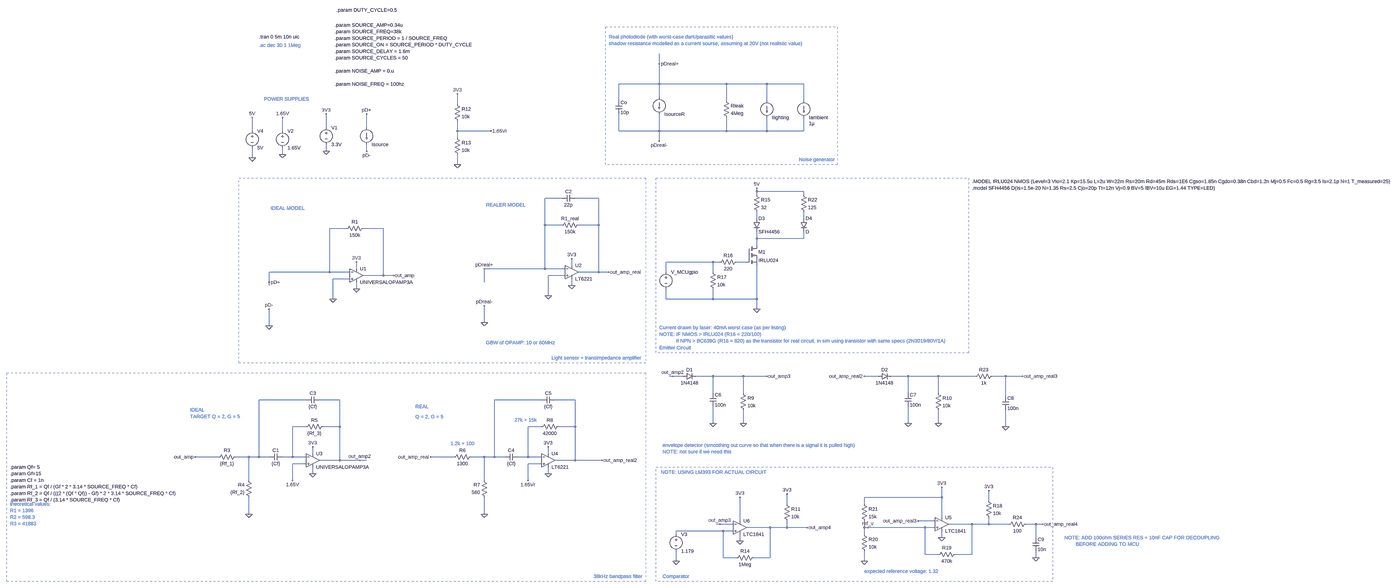
[diagram p0: schematic photodiode.asc, whole sheet]
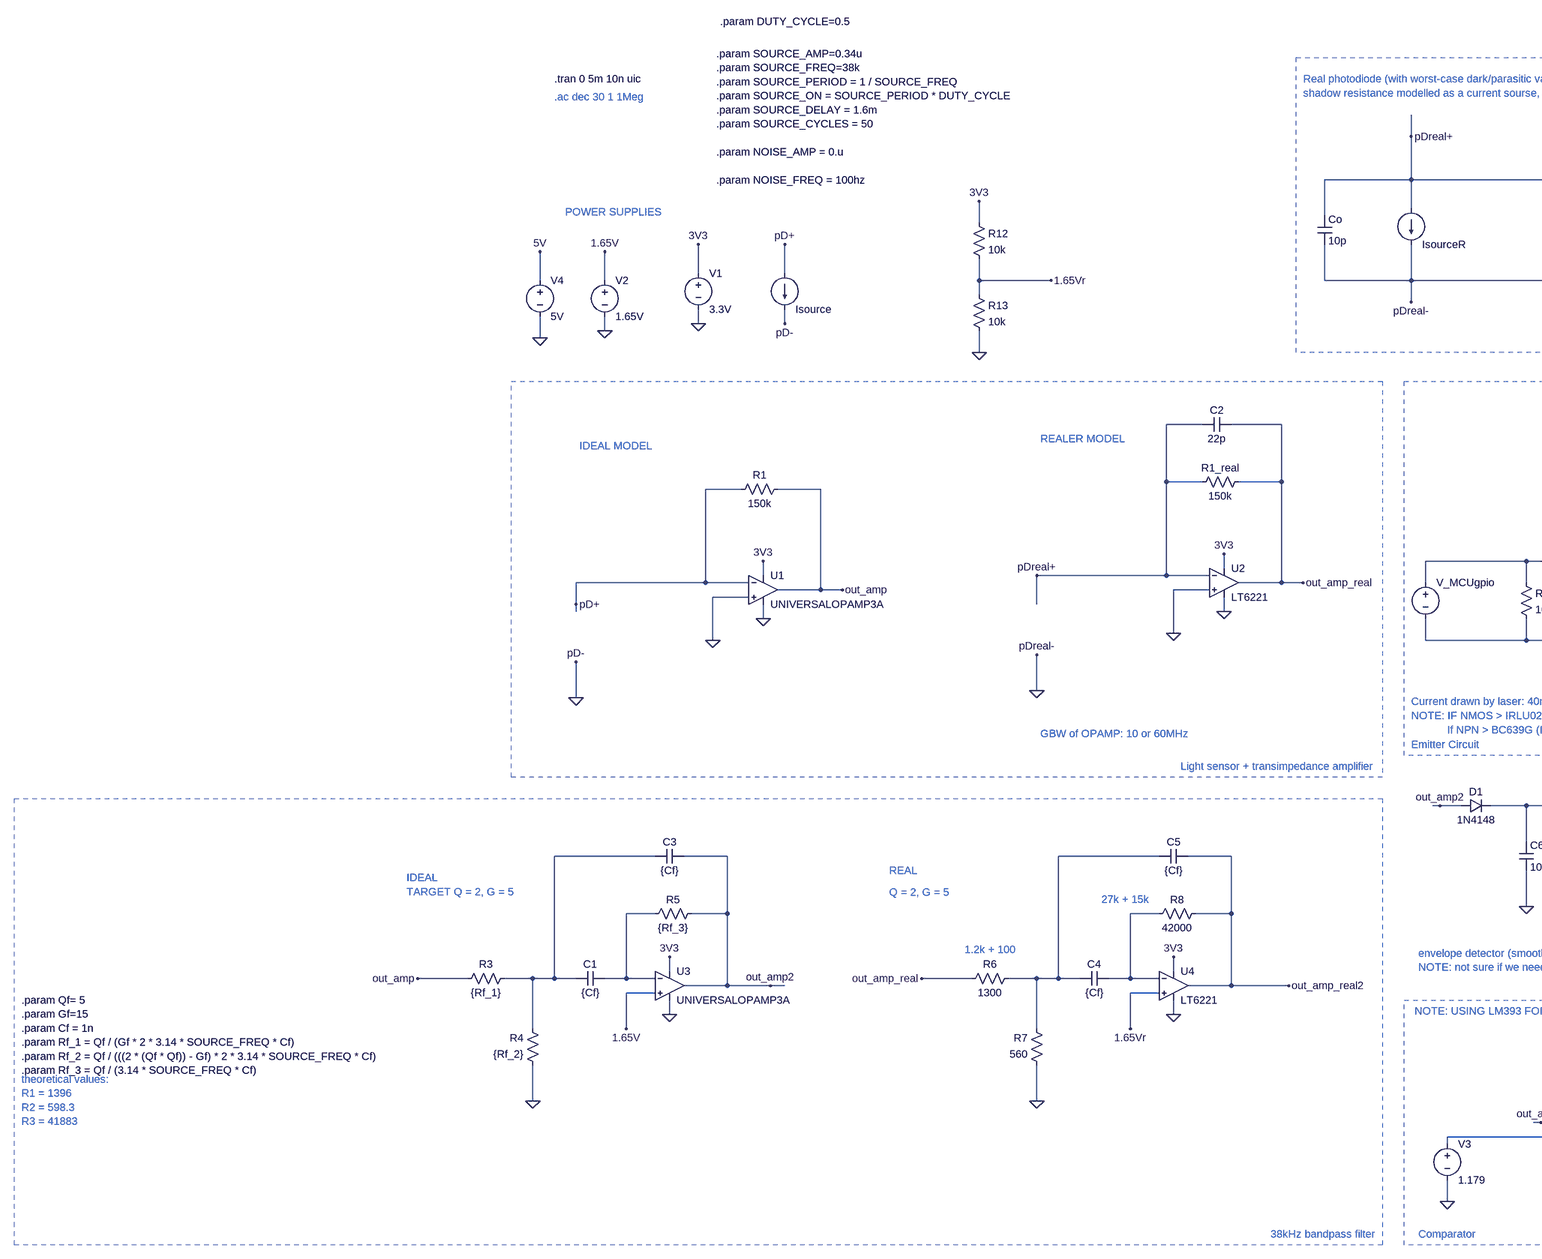
[diagram p1: schematic photodiode.asc, part, row 1 of 1, column 1 of 2]
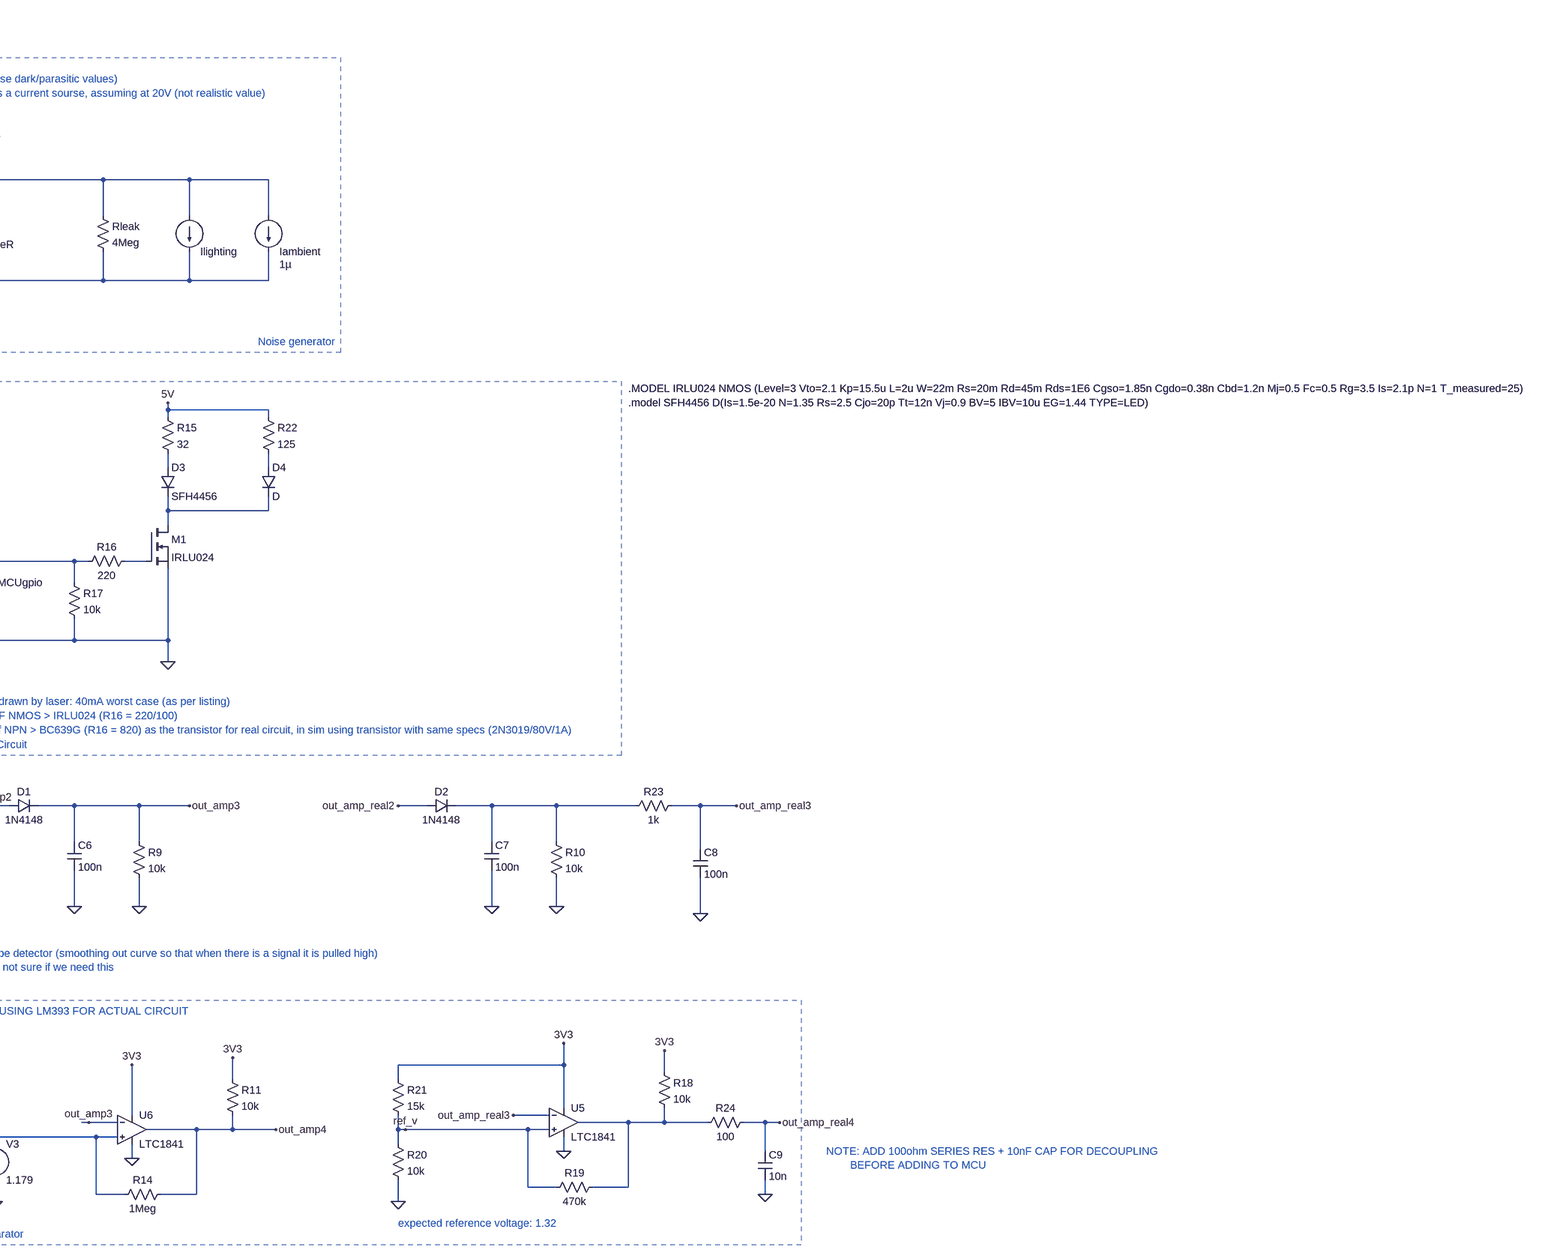
[diagram p2: schematic photodiode.asc, part, row 1 of 1, column 2 of 2]
photodiode.asc, the LTspice schematic file:
Version 4.1
SHEET 1 4684 3216
WIRE 1040 -720 1040 -768
WIRE 1040 -624 1040 -720
WIRE 1040 -624 848 -624
WIRE 1360 -624 1040 -624
WIRE 1552 -624 1360 -624
WIRE 1728 -624 1552 -624
WIRE 1040 -560 1040 -624
WIRE 848 -544 848 -624
WIRE 1360 -544 1360 -624
WIRE 1552 -544 1552 -624
WIRE 1728 -544 1728 -624
WIRE 80 -528 80 -576
WIRE -544 -416 -544 -480
WIRE -352 -416 -352 -480
WIRE -896 -400 -896 -464
WIRE -752 -400 -752 -464
WIRE 80 -400 80 -448
WIRE 240 -400 80 -400
WIRE 848 -400 848 -480
WIRE 1040 -400 1040 -480
WIRE 1040 -400 848 -400
WIRE 1360 -400 1360 -464
WIRE 1360 -400 1040 -400
WIRE 1552 -400 1552 -464
WIRE 1552 -400 1360 -400
WIRE 1728 -400 1728 -464
WIRE 1728 -400 1552 -400
WIRE 80 -368 80 -400
WIRE 1040 -352 1040 -400
WIRE -544 -304 -544 -336
WIRE -352 -304 -352 -336
WIRE -752 -288 -752 -320
WIRE -896 -272 -896 -320
WIRE 80 -240 80 -288
WIRE 1504 -112 1504 -128
WIRE 1728 -112 1504 -112
WIRE 1504 -96 1504 -112
WIRE 1728 -96 1728 -112
WIRE 576 -80 496 -80
WIRE 752 -80 640 -80
WIRE 1504 16 1504 -16
WIRE 1728 16 1728 -16
WIRE 496 48 496 -80
WIRE 576 48 496 48
WIRE 752 48 752 -80
WIRE 752 48 656 48
WIRE -448 64 -528 64
WIRE -272 64 -368 64
WIRE 1504 112 1504 80
WIRE 1728 112 1728 80
WIRE 1728 112 1504 112
WIRE 1504 144 1504 112
WIRE 1296 224 1072 224
WIRE 1328 224 1296 224
WIRE 1456 224 1408 224
WIRE 624 240 624 208
WIRE -400 256 -400 224
WIRE 496 256 496 48
WIRE 496 256 208 256
WIRE 592 256 496 256
WIRE -528 272 -528 64
WIRE -528 272 -816 272
WIRE -432 272 -528 272
WIRE 752 272 752 48
WIRE 752 272 656 272
WIRE 800 272 752 272
WIRE 1072 272 1072 224
WIRE 1296 272 1296 224
WIRE -272 288 -272 64
WIRE -272 288 -368 288
WIRE -224 288 -272 288
WIRE 592 288 512 288
WIRE -432 304 -512 304
WIRE -816 320 -816 272
WIRE 208 320 208 256
WIRE -816 336 -816 320
WIRE 624 336 624 304
WIRE -400 352 -400 320
WIRE 512 384 512 288
WIRE -512 400 -512 304
WIRE 1072 400 1072 352
WIRE 1296 400 1296 352
WIRE 1296 400 1072 400
WIRE 1504 400 1504 240
WIRE 1504 400 1296 400
WIRE 1504 448 1504 400
WIRE 208 512 208 432
WIRE -816 528 -816 448
WIRE 1104 768 1088 768
WIRE 1152 768 1104 768
WIRE 1296 768 1216 768
WIRE 1440 768 1296 768
WIRE 1552 768 1440 768
WIRE 2080 768 2016 768
WIRE 2224 768 2144 768
WIRE 2368 768 2224 768
WIRE 2544 768 2368 768
WIRE 2688 768 2624 768
WIRE 2768 768 2688 768
WIRE 1296 848 1296 768
WIRE 1440 848 1440 768
WIRE 2224 848 2224 768
WIRE 2368 848 2368 768
WIRE 2688 864 2688 768
WIRE -640 880 -864 880
WIRE -480 880 -576 880
WIRE 480 880 256 880
WIRE 640 880 544 880
WIRE 1296 992 1296 912
WIRE 1440 992 1440 928
WIRE 2224 992 2224 912
WIRE 2368 992 2368 928
WIRE -640 1008 -704 1008
WIRE -480 1008 -480 880
WIRE -480 1008 -560 1008
WIRE 480 1008 416 1008
WIRE 640 1008 640 880
WIRE 640 1008 560 1008
WIRE 2688 1008 2688 928
WIRE -608 1136 -608 1104
WIRE 512 1136 512 1104
WIRE -1056 1152 -1168 1152
WIRE -912 1152 -976 1152
WIRE -864 1152 -864 880
WIRE -864 1152 -912 1152
WIRE -816 1152 -864 1152
WIRE -704 1152 -704 1008
WIRE -704 1152 -752 1152
WIRE -640 1152 -704 1152
WIRE 64 1152 -48 1152
WIRE 208 1152 144 1152
WIRE 256 1152 256 880
WIRE 256 1152 208 1152
WIRE 304 1152 256 1152
WIRE 416 1152 416 1008
WIRE 416 1152 368 1152
WIRE 480 1152 416 1152
WIRE -480 1168 -480 1008
WIRE -480 1168 -576 1168
WIRE -384 1168 -480 1168
WIRE -352 1168 -384 1168
WIRE 640 1168 640 1008
WIRE 640 1168 544 1168
WIRE 768 1168 640 1168
WIRE -640 1184 -704 1184
WIRE 480 1184 416 1184
WIRE -608 1232 -608 1200
WIRE 512 1232 512 1200
WIRE -912 1264 -912 1152
WIRE -704 1264 -704 1184
WIRE 208 1264 208 1152
WIRE 416 1264 416 1184
WIRE 2384 1344 2384 1296
WIRE 2384 1344 2016 1344
WIRE 2608 1360 2608 1312
WIRE 1648 1376 1648 1328
WIRE 2016 1376 2016 1344
WIRE -912 1424 -912 1344
WIRE 208 1424 208 1344
WIRE 2384 1440 2384 1344
WIRE 1424 1456 1424 1344
WIRE 2352 1456 2272 1456
WIRE 1328 1472 1312 1472
WIRE 1392 1472 1328 1472
WIRE 2528 1472 2416 1472
WIRE 2608 1472 2608 1440
WIRE 2608 1472 2528 1472
WIRE 2704 1472 2608 1472
WIRE 2832 1472 2784 1472
WIRE 2864 1472 2832 1472
WIRE 1568 1488 1456 1488
WIRE 1648 1488 1648 1456
WIRE 1648 1488 1568 1488
WIRE 1744 1488 1648 1488
WIRE 2016 1488 2016 1456
WIRE 2032 1488 2016 1488
WIRE 2304 1488 2032 1488
WIRE 2352 1488 2304 1488
WIRE 1344 1504 1120 1504
WIRE 1392 1504 1344 1504
WIRE 1120 1520 1120 1504
WIRE 2016 1520 2016 1488
WIRE 2384 1536 2384 1504
WIRE 2832 1536 2832 1472
WIRE 1424 1552 1424 1520
WIRE 2304 1616 2304 1488
WIRE 2368 1616 2304 1616
WIRE 2528 1616 2528 1472
WIRE 2528 1616 2448 1616
WIRE 1344 1632 1344 1504
WIRE 1408 1632 1344 1632
WIRE 1568 1632 1568 1488
WIRE 1568 1632 1488 1632
WIRE 2832 1632 2832 1600
WIRE 1120 1648 1120 1600
WIRE 2016 1648 2016 1600
FLAG -400 352 0
FLAG -544 -304 0
FLAG -544 -480 3V3
FLAG -400 224 3V3
FLAG -224 288 out_amp
FLAG -752 -288 0
FLAG -752 -464 1.65V
FLAG -352 -304 pD-
FLAG -352 -480 pD+
FLAG -816 448 pD-
FLAG 624 336 0
FLAG 624 208 3V3
FLAG 800 272 out_amp_real
FLAG 1040 -720 pDreal+
FLAG 1040 -352 pDreal-
FLAG 208 432 pDreal-
FLAG 208 256 pDreal+
FLAG 208 512 0
FLAG -816 528 0
FLAG -512 400 0
FLAG 512 384 0
FLAG -912 1424 0
FLAG -608 1104 3V3
FLAG -608 1232 0
FLAG -384 1168 out_amp2
FLAG 208 1424 0
FLAG 512 1104 3V3
FLAG 512 1232 0
FLAG -48 1152 out_amp_real
FLAG 768 1168 out_amp_real2
FLAG -1168 1152 out_amp
FLAG -704 1264 1.65V
FLAG -816 320 pD+
FLAG 1296 992 0
FLAG 1440 992 0
FLAG 1552 768 out_amp3
FLAG 416 1264 1.65Vr
FLAG 2224 992 0
FLAG 2368 992 0
FLAG 2016 768 out_amp_real2
FLAG 2768 768 out_amp_real3
FLAG 1744 1488 out_amp4
FLAG 1424 1552 0
FLAG 1424 1344 3V3
FLAG 1648 1328 3V3
FLAG 1104 768 out_amp2
FLAG 1328 1472 out_amp3
FLAG 1120 1648 0
FLAG -896 -272 0
FLAG -896 -464 5V
FLAG 1504 -128 5V
FLAG 1504 448 0
FLAG 2384 1536 0
FLAG 2384 1296 3V3
FLAG 2608 1312 3V3
FLAG 2016 1648 0
FLAG 2272 1456 out_amp_real3
FLAG 2032 1488 ref_v
FLAG 240 -400 1.65Vr
FLAG 80 -240 0
FLAG 80 -576 3V3
FLAG 2688 1008 0
FLAG 2832 1632 0
FLAG 2864 1472 out_amp_real4
SYMBOL voltage -544 -432 R0
WINDOW 123 0 0 Left 0
WINDOW 39 0 0 Left 0
SYMATTR InstName V1
SYMATTR Value 3.3V
SYMBOL res -352 48 R90
WINDOW 0 0 56 VBottom 2
WINDOW 3 32 56 VTop 2
SYMATTR InstName R1
SYMATTR Value 150k
SYMBOL current -352 -416 R0
WINDOW 0 24 80 Left 2
WINDOW 3 24 108 Invisible 2
WINDOW 39 0 0 Left 0
SYMATTR InstName Isource
SYMATTR Value PULSE(0 {SOURCE_AMP} {SOURCE_DELAY} 5n 5n {SOURCE_ON} {SOURCE_PERIOD} {SOURCE_CYCLES})
SYMATTR Value2 AC 1 0
SYMBOL voltage -752 -416 R0
WINDOW 123 0 0 Left 0
WINDOW 39 0 0 Left 0
SYMATTR InstName V2
SYMATTR Value 1.65V
SYMBOL OpAmps\\LT6221 624 272 R0
SYMATTR InstName U2
SYMBOL res 672 32 R90
WINDOW 0 0 56 VBottom 2
WINDOW 3 32 56 VTop 2
SYMATTR InstName R1_real
SYMATTR Value 150k
SYMBOL cap 640 -96 R90
WINDOW 0 0 32 VBottom 2
WINDOW 3 32 32 VTop 2
SYMATTR InstName C2
SYMATTR Value 22p
SYMBOL cap 832 -544 R0
SYMATTR InstName Co
SYMATTR Value 10p
SYMBOL res 1344 -560 R0
SYMATTR InstName Rleak
SYMATTR Value 4Meg
SYMBOL OpAmps\\UniversalOpAmp3a -400 288 R0
SYMATTR InstName U1
SYMBOL OpAmps\\UniversalOpAmp3a -608 1168 R0
SYMATTR InstName U3
SYMBOL cap -752 1136 R90
WINDOW 0 0 32 VBottom 2
WINDOW 3 32 32 VTop 2
SYMATTR InstName C1
SYMATTR Value {Cf}
SYMBOL cap -576 864 R90
WINDOW 0 0 32 VBottom 2
WINDOW 3 32 32 VTop 2
SYMATTR InstName C3
SYMATTR Value {Cf}
SYMBOL res -960 1136 R90
WINDOW 0 0 56 VBottom 2
WINDOW 3 32 56 VTop 2
SYMATTR InstName R3
SYMATTR Value {Rf_1}
SYMBOL res -896 1360 R180
WINDOW 0 36 76 Left 2
WINDOW 3 36 40 Left 2
SYMATTR InstName R4
SYMATTR Value {Rf_2}
SYMBOL res -656 1024 R270
WINDOW 0 32 56 VTop 2
WINDOW 3 0 56 VBottom 2
SYMATTR InstName R5
SYMATTR Value {Rf_3}
SYMBOL cap 368 1136 R90
WINDOW 0 0 32 VBottom 2
WINDOW 3 32 32 VTop 2
SYMATTR InstName C4
SYMATTR Value {Cf}
SYMBOL cap 544 864 R90
WINDOW 0 0 32 VBottom 2
WINDOW 3 32 32 VTop 2
SYMATTR InstName C5
SYMATTR Value {Cf}
SYMBOL res 160 1136 R90
WINDOW 0 0 56 VBottom 2
WINDOW 3 32 56 VTop 2
SYMATTR InstName R6
SYMATTR Value 1300
SYMBOL res 224 1360 R180
WINDOW 0 36 76 Left 2
WINDOW 3 36 40 Left 2
SYMATTR InstName R7
SYMATTR Value 560
SYMBOL res 464 1024 R270
WINDOW 0 32 56 VTop 2
WINDOW 3 0 56 VBottom 2
SYMATTR InstName R8
SYMATTR Value 42000
SYMBOL OpAmps\\LT6221 512 1168 R0
SYMATTR InstName U4
SYMBOL current 1040 -560 R0
WINDOW 0 24 80 Left 2
WINDOW 3 24 0 Invisible 2
WINDOW 39 0 0 Left 0
SYMATTR InstName IsourceR
SYMATTR Value PULSE(0 {SOURCE_AMP} {SOURCE_DELAY} 5n 5n {SOURCE_ON} {SOURCE_PERIOD} {SOURCE_CYCLES})
SYMATTR Value2 AC 1 0
SYMBOL diode 1152 784 R270
WINDOW 0 32 32 VTop 2
WINDOW 3 0 32 VBottom 2
SYMATTR InstName D1
SYMATTR Value 1N4148
SYMBOL cap 1280 848 R0
SYMATTR InstName C6
SYMATTR Value 100n
SYMBOL res 1424 832 R0
SYMATTR InstName R9
SYMATTR Value 10k
SYMBOL diode 2080 784 R270
WINDOW 0 32 32 VTop 2
WINDOW 3 0 32 VBottom 2
SYMATTR InstName D2
SYMATTR Value 1N4148
SYMBOL cap 2208 848 R0
SYMATTR InstName C7
SYMATTR Value 100n
SYMBOL res 2352 832 R0
SYMATTR InstName R10
SYMATTR Value 10k
SYMBOL res 1632 1360 R0
SYMATTR InstName R11
SYMATTR Value 10k
SYMBOL res 1504 1616 R90
WINDOW 0 0 56 VBottom 2
WINDOW 3 32 56 VTop 2
SYMATTR InstName R14
SYMATTR Value 1Meg
SYMBOL Comparators\\LTC1841 1424 1488 R0
SYMATTR InstName U6
SYMBOL voltage 1120 1504 R0
WINDOW 123 0 0 Left 0
WINDOW 39 0 0 Left 0
SYMATTR InstName V3
SYMATTR Value 1.179
SYMBOL diode 1488 16 R0
SYMATTR InstName D3
SYMATTR Value SFH4456
SYMBOL voltage -896 -416 R0
WINDOW 123 0 0 Left 0
WINDOW 39 0 0 Left 0
SYMATTR InstName V4
SYMATTR Value 5V
SYMBOL res 1488 -112 R0
SYMATTR InstName R15
SYMATTR Value 32
SYMBOL res 1424 208 R90
WINDOW 0 0 56 VBottom 2
WINDOW 3 32 56 VTop 2
SYMATTR InstName R16
SYMATTR Value 220
SYMBOL res 1280 256 R0
SYMATTR InstName R17
SYMATTR Value 10k
SYMBOL voltage 1072 256 R0
WINDOW 123 0 0 Left 0
WINDOW 39 0 0 Left 0
WINDOW 3 24 96 Invisible 2
SYMATTR Value PULSE(0 3.3 0 0 0 {SOURCE_ON} {SOURCE_PERIOD})
SYMATTR InstName V_MCUgpio
SYMBOL res 2592 1344 R0
SYMATTR InstName R18
SYMATTR Value 10k
SYMBOL res 2464 1600 R90
WINDOW 0 0 56 VBottom 2
WINDOW 3 32 56 VTop 2
SYMATTR InstName R19
SYMATTR Value 470k
SYMBOL Comparators\\LTC1841 2384 1472 R0
SYMATTR InstName U5
SYMBOL res 2000 1504 R0
SYMATTR InstName R20
SYMATTR Value 10k
SYMBOL res 2000 1360 R0
SYMATTR InstName R21
SYMATTR Value 15k
SYMBOL current 1552 -544 R0
WINDOW 0 24 80 Left 2
WINDOW 3 24 108 Invisible 2
WINDOW 39 0 0 Left 0
SYMATTR InstName Ilighting
SYMATTR Value SINE(0 {NOISE_AMP} {NOISE_FREQ})
SYMATTR Value2 AC 1 0
SYMBOL current 1728 -544 R0
WINDOW 0 24 80 Left 2
WINDOW 3 24 108 Left 2
WINDOW 39 0 0 Left 0
SYMATTR InstName Iambient
SYMATTR Value 1µ
SYMATTR Value2 AC 1 0
SYMBOL res 64 -544 R0
SYMATTR InstName R12
SYMATTR Value 10k
SYMBOL res 64 -384 R0
SYMATTR InstName R13
SYMATTR Value 10k
SYMBOL res 1712 -112 R0
SYMATTR InstName R22
SYMATTR Value 125
SYMBOL diode 1712 16 R0
SYMATTR InstName D4
SYMBOL nmos 1456 144 R0
SYMATTR InstName M1
SYMATTR Value IRLU024
SYMBOL res 2640 752 R90
WINDOW 0 0 56 VBottom 2
WINDOW 3 32 56 VTop 2
SYMATTR InstName R23
SYMATTR Value 1k
SYMBOL cap 2672 864 R0
SYMATTR InstName C8
SYMATTR Value 100n
SYMBOL res 2800 1456 R90
WINDOW 0 0 56 VBottom 2
WINDOW 3 32 56 VTop 2
SYMATTR InstName R24
SYMATTR Value 100
SYMBOL cap 2816 1536 R0
SYMATTR InstName C9
SYMATTR Value 10n
TEXT -864 -848 Left 2 !.tran 0 5m 10n uic
TEXT -808 -32 Left 2 ;IDEAL MODEL
TEXT -840 -552 Left 2 ;POWER SUPPLIES
TEXT 216 -48 Left 2 ;REALER MODEL
TEXT 800 -848 Left 2 ;Real photodiode (with worst-case dark/parasitic values)\nshadow resistance modelled as a current sourse, assuming at 20V (not realistic value)
TEXT 216 608 Left 2 ;GBW of OPAMP: 10 or 60MHz
TEXT 528 680 Left 2 ;Light sensor + transimpedance amplifier
TEXT -1192 928 Left 2 ;IDEAL\nTARGET Q = 2, G = 5
TEXT 728 1720 Left 2 ;38kHz bandpass filter
TEXT -864 -808 Left 2 ;.ac dec 30 1 1Meg
TEXT -120 912 Left 2 ;REAL
TEXT -504 -904 Left 2 !.param SOURCE_AMP=0.34u\n.param SOURCE_FREQ=38k\n.param SOURCE_PERIOD = 1 / SOURCE_FREQ\n.param SOURCE_ON = SOURCE_PERIOD * DUTY_CYCLE\n.param SOURCE_DELAY = 1.6m\n.param SOURCE_CYCLES = 50\n \n.param NOISE_AMP = 0.u\n \n.param NOISE_FREQ = 100hz
TEXT -120 960 Left 2 ;Q = 2, G = 5
TEXT -2048 1200 Left 2 !.param Qf= 5\n.param Gf=15\n.param Cf = 1n\n.param Rf_1 = Qf / (Gf * 2 * 3.14 * SOURCE_FREQ * Cf)\n.param Rf_2 = Qf / (((2 * (Qf * Qf)) - Gf) * 2 * 3.14 * SOURCE_FREQ * Cf)\n.param Rf_3 = Qf / (3.14 * SOURCE_FREQ * Cf)
TEXT 1056 1096 Left 2 ;envelope detector (smoothing out curve so that when there is a signal it is pulled high)\nNOTE: not sure if we need this
TEXT 1056 1720 Left 2 ;Comparator
TEXT 1048 1224 Left 2 ;NOTE: USING LM393 FOR ACTUAL CIRCUIT
TEXT 1040 632 Left 2 ;Emitter Circuit
TEXT 2528 -128 Left 2 !.model SFH4456 D(Is=1.5e-20 N=1.35 Rs=2.5 Cjo=20p Tt=12n Vj=0.9 BV=5 IBV=10u EG=1.44 TYPE=LED)
TEXT 1040 568 Left 2 ;NOTE: IF NMOS > IRLU024 (R16 = 220/100)\n            If NPN > BC639G (R16 = 820) as the transistor for real circuit, in sim using transistor with same specs (2N3019/80V/1A)
TEXT 1040 536 Left 2 ;Current drawn by laser: 40mA worst case (as per listing)
TEXT 1704 -264 Left 2 ;Noise generator
TEXT -2048 1376 Left 2 ;theoretical values:\nR1 = 1396\nR2 = 598.3\nR3 = 41883
TEXT 48 1088 Left 2 ;1.2k + 100
TEXT 352 976 Left 2 ;27k + 15k
TEXT 2016 1696 Left 2 ;expected reference voltage: 1.32
TEXT 2968 1536 Left 2 ;NOTE: ADD 100ohm SERIES RES + 10nF CAP FOR DECOUPLING\n        BEFORE ADDING TO MCU
TEXT -496 -976 Left 2 !.param DUTY_CYCLE=0.5
TEXT 2528 -160 Left 2 !.MODEL IRLU024 NMOS (Level=3 Vto=2.1 Kp=15.5u L=2u W=22m Rs=20m Rd=45m Rds=1E6 Cgso=1.85n Cgdo=0.38n Cbd=1.2n Mj=0.5 Fc=0.5 Rg=3.5 Is=2.1p N=1 T_measured=25)
RECTANGLE Normal 976 1744 -2064 752 2
RECTANGLE Normal 2512 656 1024 -176 2
RECTANGLE Normal 1888 -240 784 -896 2
RECTANGLE Normal 976 704 -960 -176 2
RECTANGLE Normal 2912 1744 1024 1200 2

The netlist it stands for:
* photodiode.asc
V1 3V3 0 3.3V
R1 out_amp pD+ 150k
Isource pD+ 0 PULSE(0 {SOURCE_AMP} {SOURCE_DELAY} 5n 5n {SOURCE_ON} {SOURCE_PERIOD} {SOURCE_CYCLES}) AC 1 0
V2 1.65V 0 1.65V
* U2: LT6221 (symbol OpAmps\LT6221 not available, pins judged from their places): In+=0 In-=pDreal+ V+=3V3 V-=0 OUT=out_amp_real
R1_real out_amp_real pDreal+ 150k
C2 out_amp_real pDreal+ 22p
Co pDreal+ 0 10p
Rleak pDreal+ 0 4Meg
X§U1 0 pD+ 3V3 0 out_amp level3a Avol=1Meg GBW=10Meg Slew=10Meg Ilimit=25m Rail=0 Vos=0 Phimargin=45 En=0 Enk=0 In=0 Ink=0 Rin=500Meg  ; UNIVERSALOPAMP3A, pins In+ In- V+ V- OUT
X§U3 1.65V N009 3V3 0 out_amp2 level3a Avol=1Meg GBW=10Meg Slew=10Meg Ilimit=25m Rail=0 Vos=0 Phimargin=45 En=0 Enk=0 In=0 Ink=0 Rin=500Meg  ; UNIVERSALOPAMP3A, pins In+ In- V+ V- OUT
C1 N009 N007 {Cf}
C3 out_amp2 N007 {Cf}
R3 N007 out_amp {Rf_1}
R4 0 N007 {Rf_2}
R5 N009 out_amp2 {Rf_3}
C4 N010 N008 {Cf}
C5 out_amp_real2 N008 {Cf}
R6 N008 out_amp_real 1300
R7 0 N008 560
R8 N010 out_amp_real2 42000
* U4: LT6221 (symbol OpAmps\LT6221 not available, pins judged from their places): In+=1.65Vr In-=N010 V+=3V3 V-=0 OUT=out_amp_real2
IsourceR pDreal+ 0 PULSE(0 {SOURCE_AMP} {SOURCE_DELAY} 5n 5n {SOURCE_ON} {SOURCE_PERIOD} {SOURCE_CYCLES}) AC 1 0
D1 out_amp2 out_amp3 1N4148
C6 out_amp3 0 100n
R9 out_amp3 0 10k
D2 out_amp_real2 N006 1N4148
C7 N006 0 100n
R10 N006 0 10k
R11 3V3 out_amp4 10k
R14 out_amp4 N012 1Meg
* U6: LTC1841 (symbol Comparators\LTC1841 not available, pins judged from their places): In+=N012 In-=out_amp3 V+=3V3 V-=0 OUT=out_amp4
V3 N012 0 1.179
D3 N001 N003 SFH4456
V4 5V 0 5V
R15 5V N001 32
R16 N005 N004 220
R17 N004 0 10k
V_MCUgpio N004 0 PULSE(0 3.3 0 0 0 {SOURCE_ON} {SOURCE_PERIOD})
R18 3V3 N011 10k
R19 N011 ref_v 470k
* U5: LTC1841 (symbol Comparators\LTC1841 not available, pins judged from their places): In+=ref_v In-=out_amp_real3 V+=3V3 V-=0 OUT=N011
R20 ref_v 0 10k
R21 3V3 ref_v 15k
Ilighting pDreal+ 0 SINE(0 {NOISE_AMP} {NOISE_FREQ}) AC 1 0
Iambient pDreal+ 0 1µ AC 1 0
R12 3V3 1.65Vr 10k
R13 1.65Vr 0 10k
R22 5V N002 125
D4 N002 N003 D
M1 N003 N005 0 0 IRLU024
R23 out_amp_real3 N006 1k
C8 out_amp_real3 0 100n
R24 out_amp_real4 N011 100
C9 out_amp_real4 0 10n
.model D D
.lib standard.dio
.model NMOS NMOS
.model PMOS PMOS
.lib standard.mos
.tran 0 5m 10n uic
* IDEAL MODEL
* POWER SUPPLIES
* REALER MODEL
* Real photodiode (with worst-case dark/parasitic values)
* shadow resistance modelled as a current sourse, assuming at 20V (not realistic value)
* GBW of OPAMP: 10 or 60MHz
* Light sensor + transimpedance amplifier
* IDEAL
* TARGET Q = 2, G = 5
* 38kHz bandpass filter
* .ac dec 30 1 1Meg
* REAL
.param SOURCE_AMP=0.34u
.param SOURCE_FREQ=38k
.param SOURCE_PERIOD = 1 / SOURCE_FREQ
.param SOURCE_ON = SOURCE_PERIOD * DUTY_CYCLE
.param SOURCE_DELAY = 1.6m
.param SOURCE_CYCLES = 50
.param NOISE_AMP = 0.u
.param NOISE_FREQ = 100hz
* Q = 2, G = 5
.param Qf= 5
.param Gf=15
.param Cf = 1n
.param Rf_1 = Qf / (Gf * 2 * 3.14 * SOURCE_FREQ * Cf)
.param Rf_2 = Qf / (((2 * (Qf * Qf)) - Gf) * 2 * 3.14 * SOURCE_FREQ * Cf)
.param Rf_3 = Qf / (3.14 * SOURCE_FREQ * Cf)
* envelope detector (smoothing out curve so that when there is a signal it is pulled high)
* NOTE: not sure if we need this
* Comparator
* NOTE: USING LM393 FOR ACTUAL CIRCUIT
* Emitter Circuit
.model SFH4456 D(Is=1.5e-20 N=1.35 Rs=2.5 Cjo=20p Tt=12n Vj=0.9 BV=5 IBV=10u EG=1.44 TYPE=LED)
* NOTE: IF NMOS > IRLU024 (R16 = 220/100)
*             If NPN > BC639G (R16 = 820) as the transistor for real circuit, in sim using transistor with same specs (2N3019/80V/1A)
* Current drawn by laser: 40mA worst case (as per listing)
* Noise generator
* theoretical values:
* R1 = 1396
* R2 = 598.3
* R3 = 41883
* 1.2k + 100
* 27k + 15k
* expected reference voltage: 1.32
* NOTE: ADD 100ohm SERIES RES + 10nF CAP FOR DECOUPLING
*         BEFORE ADDING TO MCU
.param DUTY_CYCLE=0.5
.MODEL IRLU024 NMOS (Level=3 Vto=2.1 Kp=15.5u L=2u W=22m Rs=20m Rd=45m Rds=1E6 Cgso=1.85n Cgdo=0.38n Cbd=1.2n Mj=0.5 Fc=0.5 Rg=3.5 Is=2.1p N=1 T_measured=25)
.backanno
.end